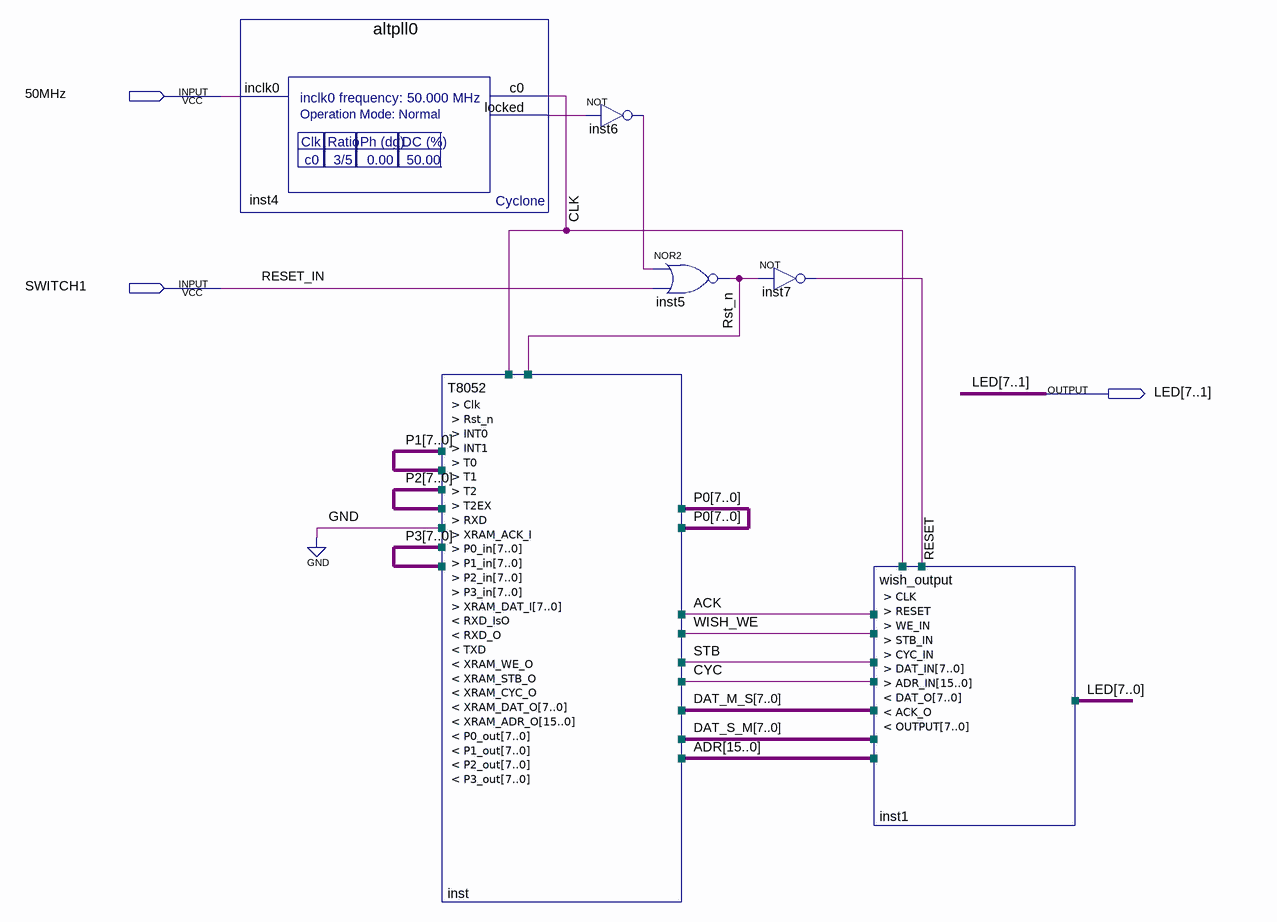
[diagram p0: schematic sheet]
// Quartus schematic ex13.bdf as structural Verilog: 6 symbols, 3 pins
module ex13 (
  input  \50MHz ,
  input  SWITCH1,
  output [7:0] LED
);

  wire ACK, CLK, CYC, inst4_locked, inst6_out, RESET, Rst_n, STB, WISH_WE;
  wire [7:0] DAT_M_S, DAT_S_M, P0, P1, P2, P3;
  wire [15:0] ADR;

  altpll0 inst4 (.inclk0(\50MHz ), .c0(CLK), .locked(inst4_locked));
  T8052 inst (
    .Clk(CLK), .Rst_n(Rst_n), .INT0(1'b0), .INT1(1'b0), .T0(1'b0), .T1(1'b0), .T2(1'b0), .T2EX(1'b0),
    .RXD(1'b0), .XRAM_ACK_I(ACK), .P0_in(P0), .P1_in(P1), .P2_in(P2), .P3_in(P3), .XRAM_DAT_I(DAT_S_M),
    .XRAM_WE_O(WISH_WE), .XRAM_STB_O(STB), .XRAM_CYC_O(CYC), .XRAM_DAT_O(DAT_M_S), .XRAM_ADR_O(ADR),
    .P0_out(P0), .P1_out(P1), .P2_out(P2), .P3_out(P3));  // open: RXD_IsO, RXD_O, TXD
  not inst6 (inst6_out, inst4_locked);
  nor inst5 (Rst_n, inst6_out, SWITCH1);
  not inst7 (RESET, Rst_n);
  wish_output inst1 (
    .CLK(CLK), .RESET(RESET), .WE_IN(WISH_WE), .STB_IN(STB), .CYC_IN(CYC), .DAT_IN(DAT_M_S), .ADR_IN(ADR),
    .DAT_O(DAT_S_M), .ACK_O(ACK), .OUTPUT(LED));

  // Other names for the same wires on the sheet: RESET_IN = SWITCH1
endmodule
